# EAGLE design OpenHAS_OutputBoard_v1.0 (EAGLE 7.3.0)
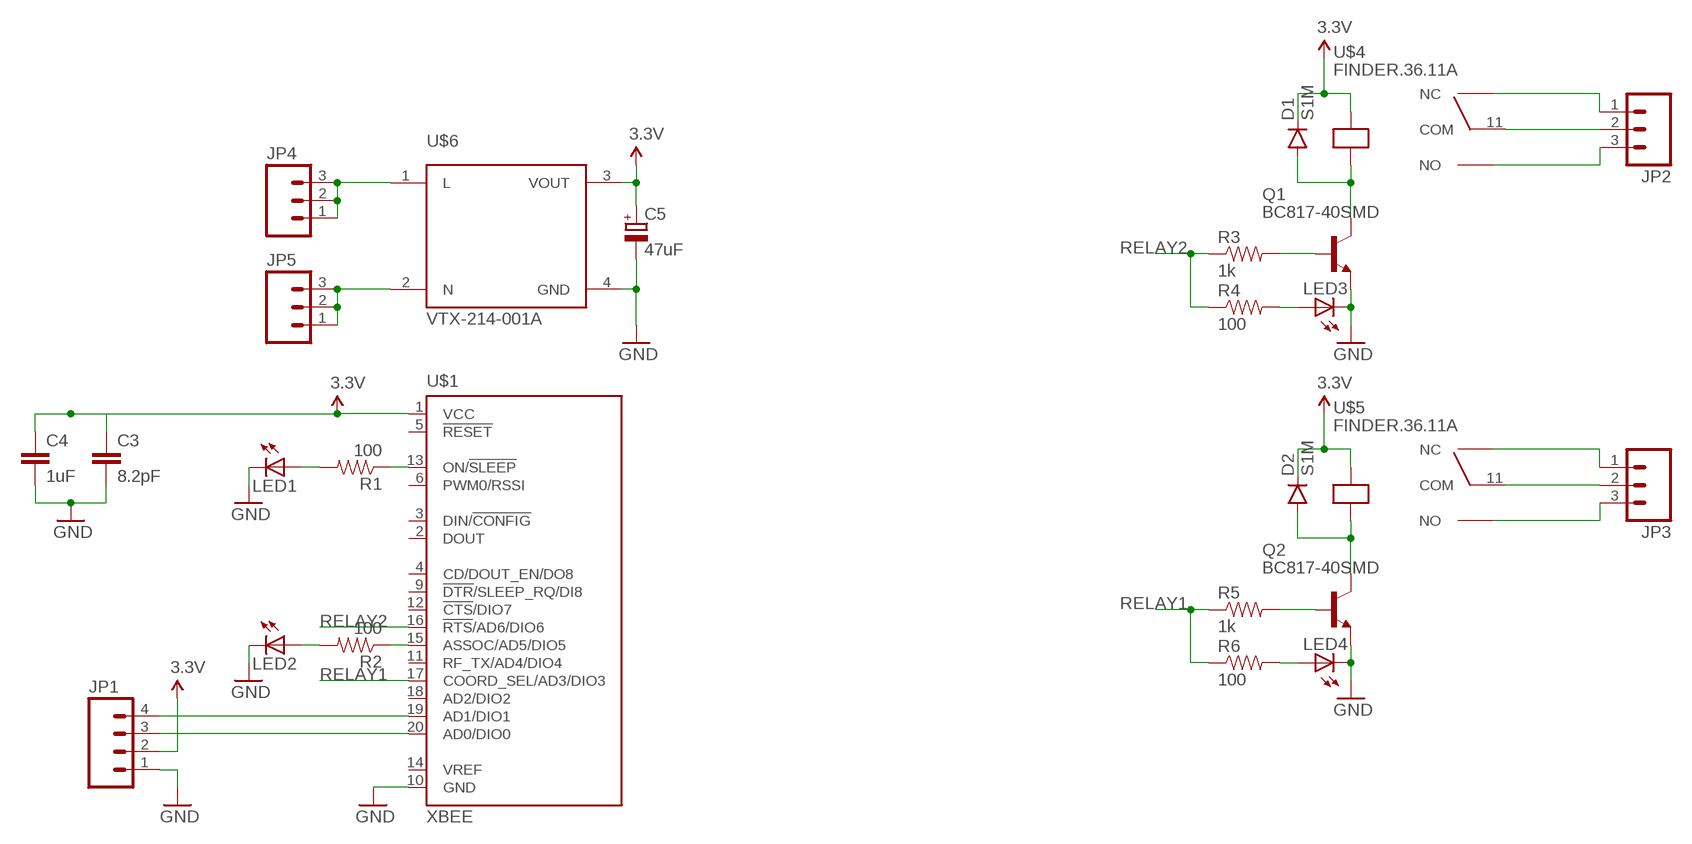
[diagram p0: schematic, sheet 1]

## Parts
C3  8.2pF  CAP0805  [0805]
C4  1uF  CAP0805  [0805]
C5  47uF  CPOL-EUE2-5  [E2-5]
D1  S1M  DIODESMA  [SMA-DIODE]
D2  S1M  DIODESMA  [SMA-DIODE]
JP1  M04SCREW  [SCREWTERMINAL-3.5MM-4]
JP2  M03-SCREW-5MM  [SCREWTERMINAL-5MM-3]
JP3  M03-SCREW-5MM  [SCREWTERMINAL-5MM-3]
JP4  M03-SCREW-5MM  [SCREWTERMINAL-5MM-3]
JP5  M03-SCREW-5MM  [SCREWTERMINAL-5MM-3]
LED1  LEDCHIP-LED0805  [CHIP-LED0805]
LED2  LEDCHIP-LED0805  [CHIP-LED0805]
LED3  LEDCHIP-LED0805  [CHIP-LED0805]
LED4  LEDCHIP-LED0805  [CHIP-LED0805]
Q1  BC817-40SMD  [SOT23-BEC]
Q2  BC817-40SMD  [SOT23-BEC]
R1  100  RESISTOR0805-RES  [0805]
R2  100  RESISTOR0805-RES  [0805]
R3  1k  RESISTOR0805-RES  [0805]
R4  100  RESISTOR0805-RES  [0805]
R5  1k  RESISTOR0805-RES  [0805]
R6  100  RESISTOR0805-RES  [0805]
U$1  XBEE  [XBEE]
U$4  FINDER.36.11A  [31.11]
U$5  FINDER.36.11A  [31.11]
U$6  VTX-214-001A  [VTX-214-003-X]

## Nets
3.3V: C3.1 C4.1 C5.+ D1.C D2.C JP1.2 U$1.1(VCC) U$4.A1 U$5.A1 U$6.3(VOUT)
GND: C3.2 C4.2 C5.- JP1.1 LED1.C LED2.C LED3.C LED4.C Q1.E Q2.E U$1.10(GND) U$6.4(GND)
N$1: LED2.A R2.2
N$2: D1.A Q1.C U$4.A2
N$3: LED3.A R4.2
N$4: JP2.2 U$4.11(COM)
N$5: LED1.A R1.2
N$6: Q1.B R3.2
N$7: JP2.3 U$4.14(NO)
N$8: JP2.1 U$4.12(NC)
N$9: JP3.2 U$5.11(COM)
N$10: JP5.1 JP5.2 JP5.3 U$6.2(N)
N$11: JP4.1 JP4.2 JP4.3 U$6.1(L)
N$12: D2.A Q2.C U$5.A2
N$13: Q2.B R5.2
N$14: LED4.A R6.2
N$15: JP3.3 U$5.14(NO)
N$16: JP3.1 U$5.12(NC)
N$17: R2.1 U$1.15(ASSOC/AD5/DIO5)
N$18: R1.1 U$1.13(ON/!SLEEP)
N$19: JP1.3 U$1.20(AD0/DIO0)
N$20: JP1.4 U$1.19(AD1/DIO1)
RELAY1: R5.1 R6.1 U$1.17(COORD_SEL/AD3/DIO3)
RELAY2: R3.1 R4.1 U$1.16(!RTS!/AD6/DIO6)
Unconnected: U$1.2(DOUT) U$1.3(DIN/!CONFIG) U$1.4(CD/DOUT_EN/DO8) U$1.5(!RESET) U$1.6(PWM0/RSSI) U$1.9(!DTR!/SLEEP_RQ/DI8) U$1.11(RF_TX/AD4/DIO4) U$1.12(!CTS!/DIO7) U$1.14(VREF) U$1.18(AD2/DIO2)

## Library data of the parts
C3 C4 = SparkFun-Passives:CAP: Capacitor Standard 0603 ceramic capacitor, and 0.1" leaded capacitor.
C5 = rcl:CPOL-EU: POLARIZED CAPACITOR, European symbol; BOM: http://www.soselectronic.hu/?str=371&artnum=64415&name=samwha-elra-47uf-35v-sd#tabs-2
D1 D2 = SparkFun-DiscreteSemi:DIODE: Diode These are standard reverse protection diodes and small signal diodes. SMA package can handle up to about 1A. SOD-323 can handle about 200mA. What the SOD-323 package when ordering, there are some mfgs out there that are 5-pin packages.
JP1 = SparkFun-Connectors:M04: Header 4 Standard 4-pin 0.1" header. Use with straight break away headers (SKU : PRT-00116), right angle break away headers (PRT-00553), swiss pins (PRT-00743), machine pins (PRT-00117), and female headers (PRT-00115). Molex polarized connector foot print use with SKU : PRT-08231 with associated crimp pins and housings. 1MM SMD Version SKU: PRT-10208; PROD_ID: Combine 2x8399
JP2-JP5 = SparkFun-Connectors:M03: Header 3 Standard 3-pin 0.1" header. Use with straight break away headers (SKU : PRT-00116), right angle break away headers (PRT-00553), swiss pins (PRT-00743), machine pins (PRT-00117), and female headers (PRT-00115). Molex polarized connector foot print use with SKU : PRT-08232 with associated crimp pins and housings.; STOREFRONT_ID: PRT-08433
LED1-LED4 = led:LED: LED OSRAM: - CHIPLED LG R971, LG N971, LY N971, LG Q971, LY Q971, LO R971, LY R971 LH N974, LH R974 LS Q976, LO Q976, LY Q976 LO Q996 - Hyper CHIPLED LW Q18S LB Q993, LB Q99A, LB R99A - SideLED LS A670, LO A670, LY A670, LG A670, LP A670 LB A673, LV A673, LT A673, LW A673 LH A674 LY A675 LS A676, LA A676, LO A676, LY A676, LW A676 LS A679, LY A679, LG A679 - Hyper Micro SIDELED® LS Y876, LA Y876, LO Y876, LY Y876 LT Y87S - SmartLED LW L88C, LW L88S LB L89C, LB L89S, LG L890 LS L89K, LO L89K, LY L89K LS L896, LA L896, LO L896, LY L896 - TOPLED LS T670, LO T670, LY T670, LG T670, LP T670 LSG T670, LSP T670, LSY T670, LOP T670, LYG T670 LG T671, LOG T671, LSG T671 LB T673, LV T673, LT T673, LW T673 LH T674 LS T676, LA T676, LO T676, LY T676, LB T676, LH T676, LSB T676, LW T676 LB T67C, LV T67C, LT T67C, LS T67K, LO T67K, LY T67K, LW E67C LS E67B, LA E67B, LO E67B, LY E67B, LB E67C, LV E67C, LT E67C LW T67C LS T679, LY T679, LG T679 LS T770, LO T770, LY T770, LG T770, LP T770 LB T773, LV T773, LT T773, LW T773 LH T774 LS E675, LA E675, LY E675, LS T675 LS T776, LA T776, LO T776, LY T776, LB T776 LHGB T686 LT T68C, LB T68C - Hyper Mini TOPLED® LB M676 - Mini TOPLED Santana® LG M470 LS M47K, LO M47K, LY M47K Source: http://www.osram.convergy.de LUXEON: - LUMILED® LXK2-PW12-R00, LXK2-PW12-S00, LXK2-PW14-U00, LXK2-PW14-V00 LXK2-PM12-R00, LXK2-PM12-S00, LXK2-PM14-U00 LXK2-PE12-Q00, LXK2-PE12-R00, LXK2-PE12-S00, LXK2-PE14-T00, LXK2-PE14-U00 LXK2-PB12-K00, LXK2-PB12-L00, LXK2-PB12-M00, LXK2-PB14-N00, LXK2-PB14-P00, LXK2-PB14-Q00 LXK2-PR12-L00, LXK2-PR12-M00, LXK2-PR14-Q00, LXK2-PR14-R00 LXK2-PD12-Q00, LXK2-PD12-R00, LXK2-PD12-S00 LXK2-PH12-R00, LXK2-PH12-S00 LXK2-PL12-P00, LXK2-PL12-Q00, LXK2-PL12-R00 Source: www.luxeon.com KINGBRIGHT: KA-3528ASYC Source: www.kingbright.com
Q1 Q2 = transistor-npn:BC817*: NPN Transistor
R1 R2 R4 R6 = SparkFun-Passives:RESISTOR: Resistor Basic schematic elements and footprints for 0603, 1206, and PTH resistors.
R3 R5 = SparkFun-Resistors:RESISTOR: Resistor Basic schematic elements and footprints for 0603, 1206, and PTH resistors.
U$1 = maxstream:XBEE: XBee (TM) /XBee-PRO(TM) OEM RF Modules Source: MaxStream, Inc. xbee_productmanual.pdf; MPN: XBP24-Z7UIT-004; OC_FARNELL: 1751799; OC_NEWARK: 34R5507
U$4 U$5 = CustomComponents:FINDER.36.11
U$6 = CustomComponents:VTX-214-001: Vigortronix 3 Watt AC-DC Converters for the VTX-214-003- series

## Board
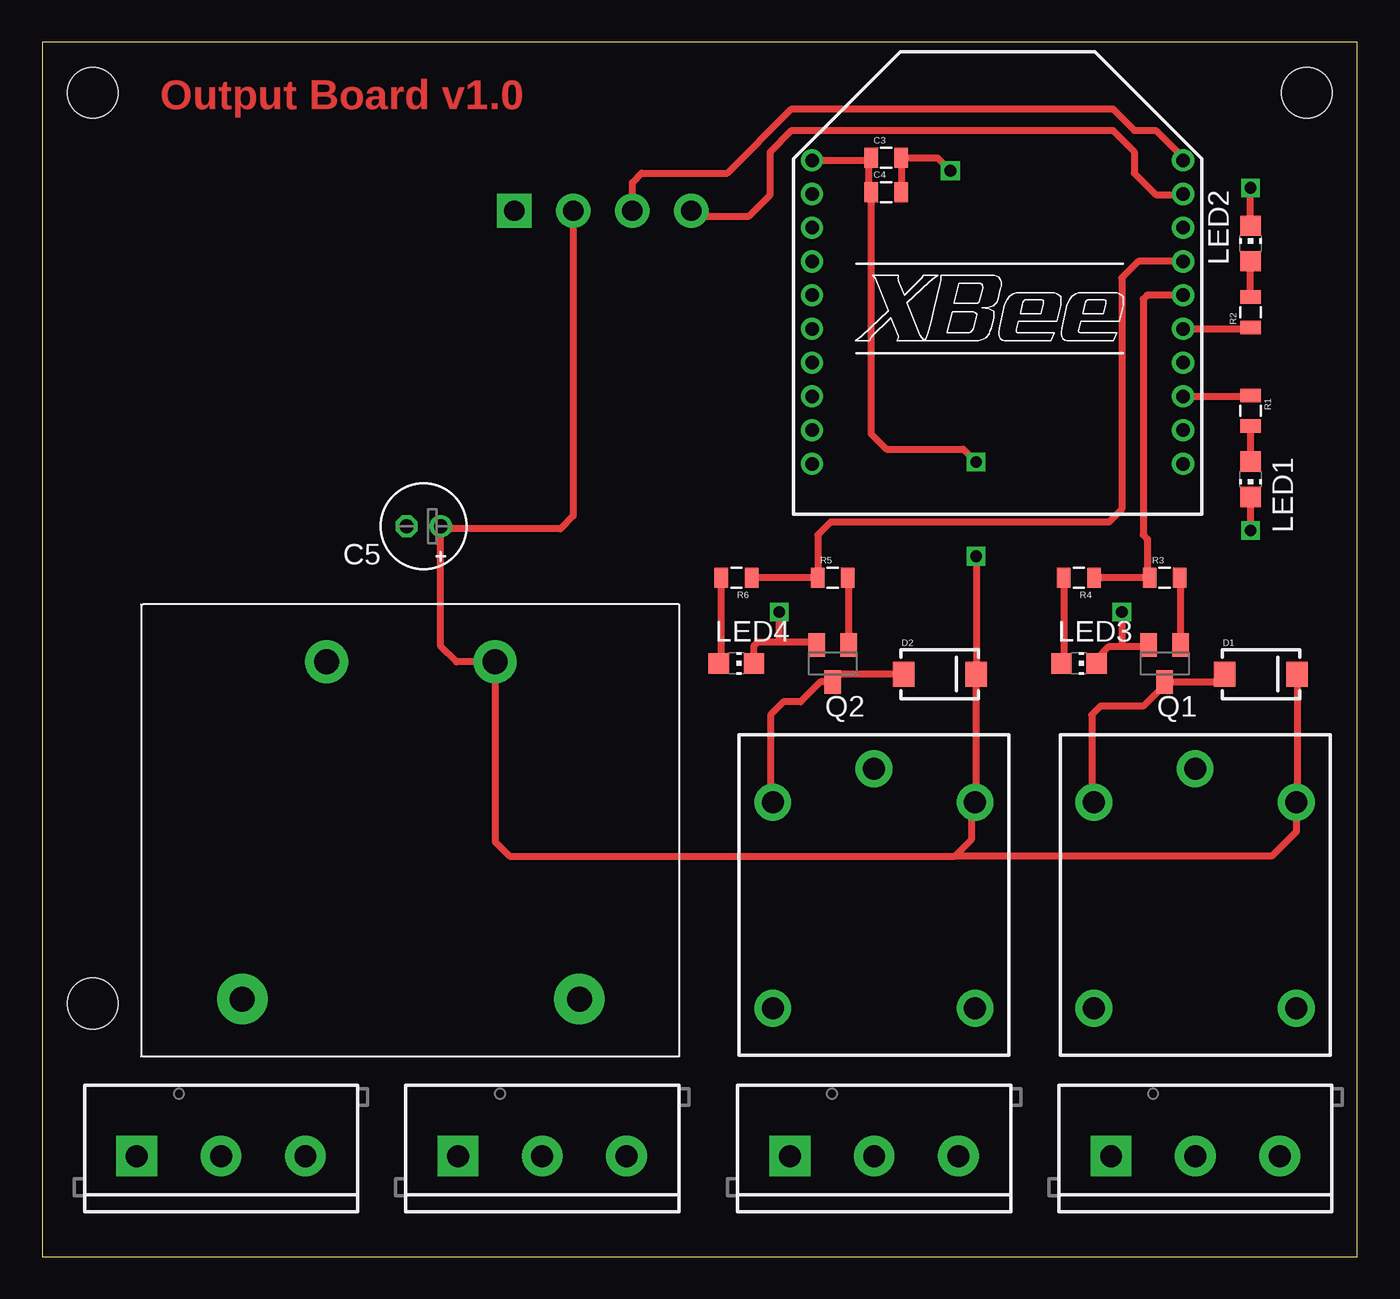
[diagram p1: board, top side]
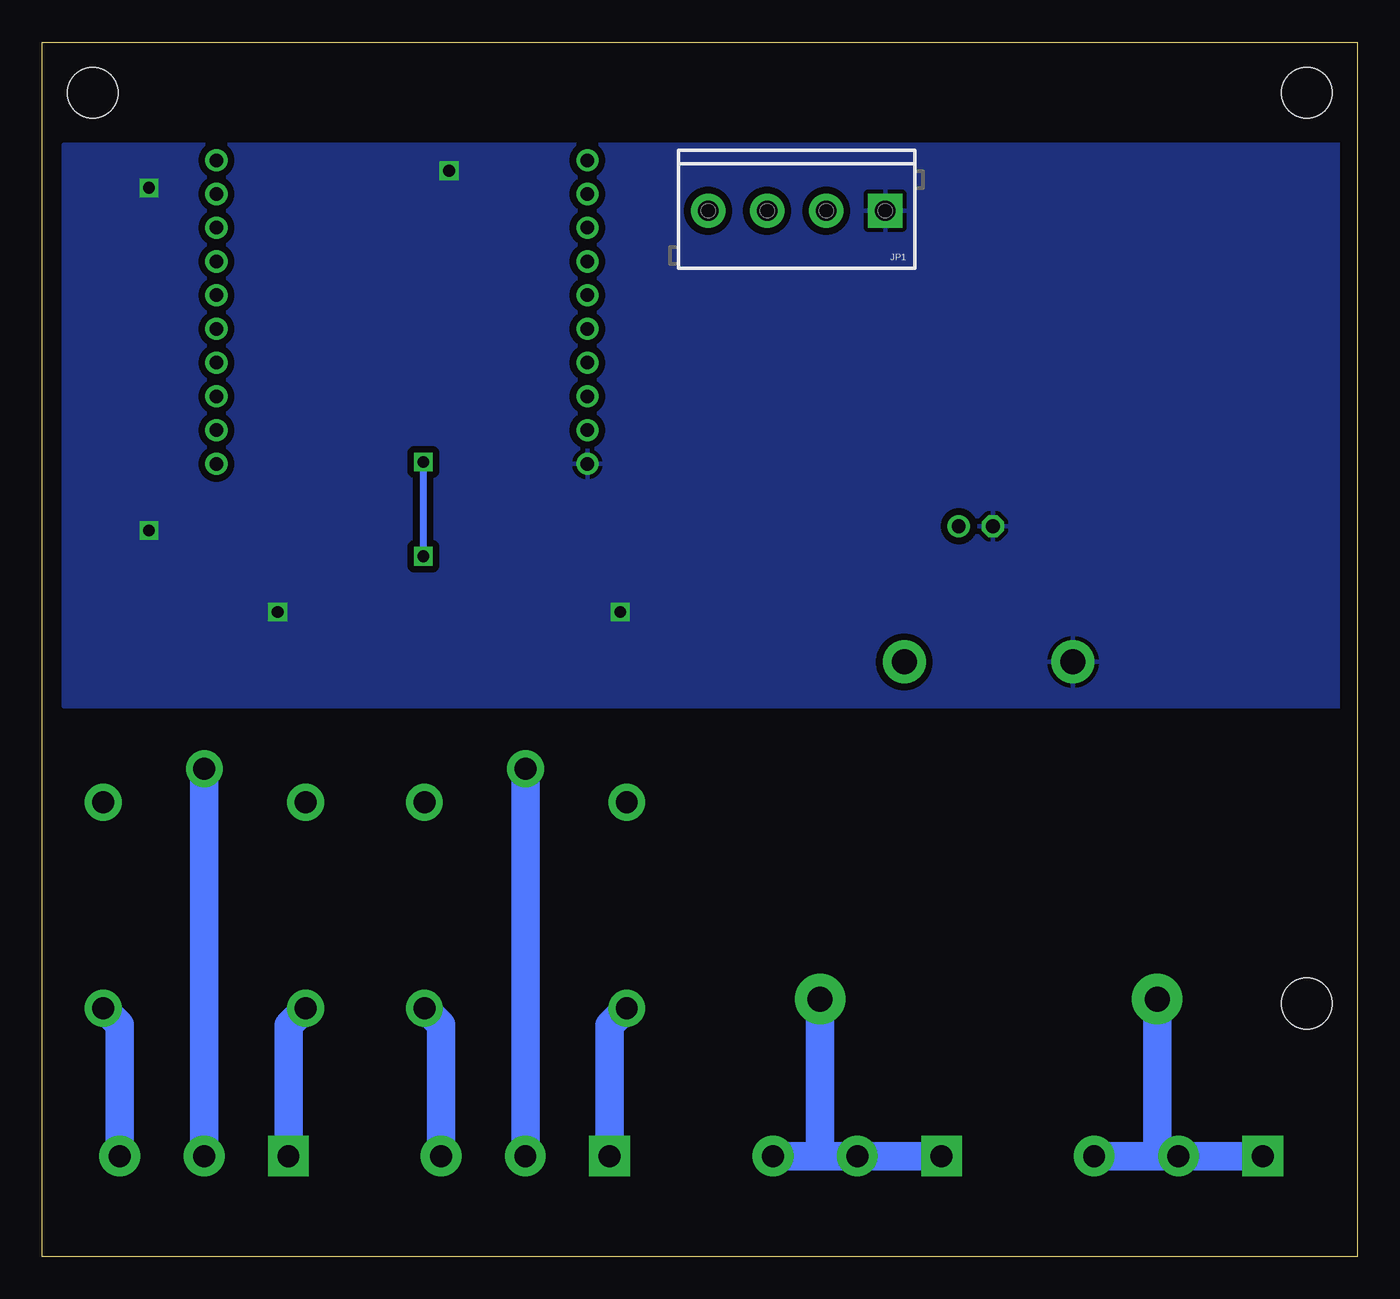
[diagram p2: board, bottom side, seen from below]

Size 78 x 72 mm. Coordinates in mm from the lower left corner, seen from the top.
Outline: 0,72 0,0 78,0 78,72 0,72
Copper layers (1*16): Top 0.035mm / dielectric 1.5mm / Bottom 0.035mm
Design rules "12": minimum track width 12mil, minimum drill 24mil, track to track 12mil, track to pad 12mil, pad to pad 12mil, via to via 12mil, smd to smd 12mil, copper to edge 40mil, drill to drill 12mil, minimum pad ring 10mil, minimum via ring 8mil, stop-mask expansion 4mil, vias tented up to drill 0mil, thermal gap 10mil
Holes 3 mm at 3,69 75,69 3,15

### Footprints (pad centres in the part's own frame; a part is rotated, then mirrored left to right if it is on the bottom)
0805 = smd 0.8 x 1.2: 1 -0.9,0; 2 0.9,0
E2-5 = drill 0.813 pad 1.27: + -1.016,0 | drill 0.813 pad 1.27 octagon: - 1.016,0
SMA-DIODE = smd 1.27 x 1.47: A -2.15,0; C 2.15,0
SCREWTERMINAL-3.5MM-4 = drill 1.2 pad 2.032 square: 1 0,0 | drill 1.2 pad 2.032: 2 3.5,0; 3 7,0; 4 10.5,0
SCREWTERMINAL-5MM-3 = drill 1.3 pad 2.413 square: 1 0,0 | drill 1.3 pad 2.413: 2 5,0; 3 10,0
CHIP-LED0805 = smd 1.2 x 1.2: A 0,-1.05; C 0,1.05
SOT23-BEC = smd 1 x 1.4: B -0.95,-1.1; C 0,1.1; E 0.95,-1.1
XBEE = drill 0.8 pad 1.27: 1 -11,9; 2 -11,7; 3 -11,5; 4 -11,3; 5 -11,1; 6 -11,-1; 7 -11,-3; 8 -11,-5; 9 -11,-7; 10 -11,-9; 11 11,-9; 12 11,-7; 13 11,-5; 14 11,-3; 15 11,-1; 16 11,1; 17 11,3; 18 11,5; 19 11,7; 20 11,9
31.11 = drill 1.3 pad 2.184: 11 -9,-2; 12 5.2,-8; 14 5.2,4; A1 -7,4; A2 -7,-8
VTX-214-003-X = drill 1.5 pad 3: 1 10,10; 2 -10,10 | drill 1.5 pad 2.54: 3 -5,-10; 4 5,-10

### Placement (x,y rotation side)
C3  50.06,65.14 0 top
C4  50.06,63.11 0 top
C5  22.63,43.3 180 top
D1  72.28,34.53 0 top
D2  53.23,34.53 0 top
JP1  28,62 180 bottom
JP2  63.4,5.96 0 top
JP3  44.34,5.96 0 top
JP4  5.61,5.96 0 top
JP5  24.66,5.96 0 top
LED1  71.67,46.09 180 top
LED2  71.67,60.06 0 top
LED3  61.49,35.17 270 top
LED4  41.17,35.17 270 top
Q1  66.57,35.17 180 top
Q2  46.88,35.17 180 top
R1  71.67,50.16 270 top
R2  71.67,56 90 top
R3  66.57,40.25 0 top
R4  61.49,40.25 180 top
R5  46.88,40.25 0 top
R6  41.17,40.25 180 top
U$1  56.66,56 0 top
U$4  70.38,19.93 270 top
U$5  51.33,19.93 270 top
U$6  21.87,25.26 180 top

### Tracks (layer width: path | path; a pad name or v marks a point on that pad's centre or on a via)
3.3V  (via drill 0.7)
  Top 0.406: U$1.1 49.02,65 | 49.02,65 C3.1 | 49.02,65 49.02,63.25 C4.1 49.16,48.77 50.06,47.87 54.63,47.87 v55.39,47.11 | D1.C 74.44,26.98 U$4.A1 74.38,25.2 72.92,23.74 54.12,23.74 | 54.12,23.74 27.71,23.74 26.87,24.58 U$6.3 24.57,35.26 23.64,36.19 C5.+ 23.79,43.15 30.73,43.15 31.5,43.91 JP1.2 | 54.12,23.74 55.14,24.76 55.14,26.74 U$5.A1 55.38,26.98 D2.C 55.39,34.54 v55.39,41.52
  Bottom 0.406: v55.39,47.11 v55.39,41.52
GND  (via drill 0.7)
  Top 0.406: LED2.C v71.67,63.36 | LED1.C v71.67,43.04 | C4.2 C3.2 53.11,65.14 v53.87,64.38 | LED3.C 62.54,35.46 63.27,36.19 64.03,36.19 | 64.03,36.19 65.54,36.19 Q1.E | LED4.C 42.22,36.22 42.44,36.44 43.71,36.44 | 43.71,36.44 45.77,36.44 Q2.E | v64.03,38.22 64.03,36.19 | v43.71,38.22 43.71,36.44
  pour Bottom (isolate 0.406): 76.73,32.63 0.88,32.63 0.88,65.92 76.73,65.92
N$1
  Top 0.406: R2.2 LED2.A
N$2
  Top 0.406: D1.A 69.67,34.07 Q1.C 66.57,33.9 65.3,32.63 62.76,32.63 62.25,32.12 62.25,27.06 U$4.A2
N$3
  Top 0.406: R4.2 60.59,35.32 LED3.A
N$4
  Bottom 1.676: JP2.2 68.39,28.91 U$4.11
N$5
  Top 0.406: R1.2 LED1.A
N$6
  Top 0.406: Q1.B 67.52,40.2 R3.2
N$7
  Bottom 1.676: JP2.3 73.39,13.74 U$4.14
N$8
  Bottom 1.676: JP2.1 63.4,13.71 U$4.12
N$9
  Bottom 1.676: JP3.2 49.34,28.91 U$5.11
N$10
  Bottom 1.676: JP5.1 JP5.2 32.28,5.96 | 32.28,5.96 JP5.3 | U$6.2 31.87,6.37 32.28,5.96
N$11
  Bottom 1.676: JP4.1 JP4.2 11.96,5.96 | 11.96,5.96 JP4.3 | U$6.1 11.87,6.05 11.96,5.96
N$12
  Top 0.406: D2.A 47.35,34.53 Q2.C 46.17,34.07 44.98,32.88 43.96,32.88 43.2,32.12 43.2,27.06 U$5.A2
N$13
  Top 0.406: Q2.B 47.84,40.2 R5.2
N$14
  Top 0.406: R6.2 40.27,35.32 LED4.A
N$15
  Bottom 1.676: JP3.3 54.34,13.74 U$5.14
N$16
  Bottom 1.676: JP3.1 44.34,13.71 U$5.12
N$17
  Top 0.406: U$1.15 71.57,55 R2.1
N$18
  Top 0.406: U$1.13 71.61,51 R1.1
N$19
  Top 0.406: JP1.3 35,63.67 35.56,64.23 40.64,64.23 44.45,68.04 63.5,68.04 64.77,66.77 66.04,66.77 67.31,65.5 67.31,65.35 U$1.20
N$20
  Top 0.406: JP1.4 39.06,62 39.37,61.69 41.91,61.69 43.18,62.96 43.18,65.5 44.45,66.77 63.5,66.77 64.77,65.5 64.77,64.23 66.04,62.96 67.63,62.96 U$1.19
RELAY1
  Top 0.406: R6.1 R5.1 46,40.26 46,42.79 46.76,43.55 63.27,43.55 64.03,44.31 64.03,58.03 65,59 U$1.17
RELAY2
  Top 0.406: R4.1 R3.1 65.55,40.37 65.55,42.54 65.3,42.79 65.3,56.76 65.54,57 U$1.16

### Text on the board
Top: Output Board v1.0
tDocu: ASS | 1: GND / 2: 3.3V / 3: Input 1 / 4: Input 2 | ON | AC N | AC L | NC COM NO | NC COM NO